# Altium schematic sheet Level Shifter.SchDoc
size A4; DocumentNumber: 4; SheetNumber: 5; SheetTotal: 5
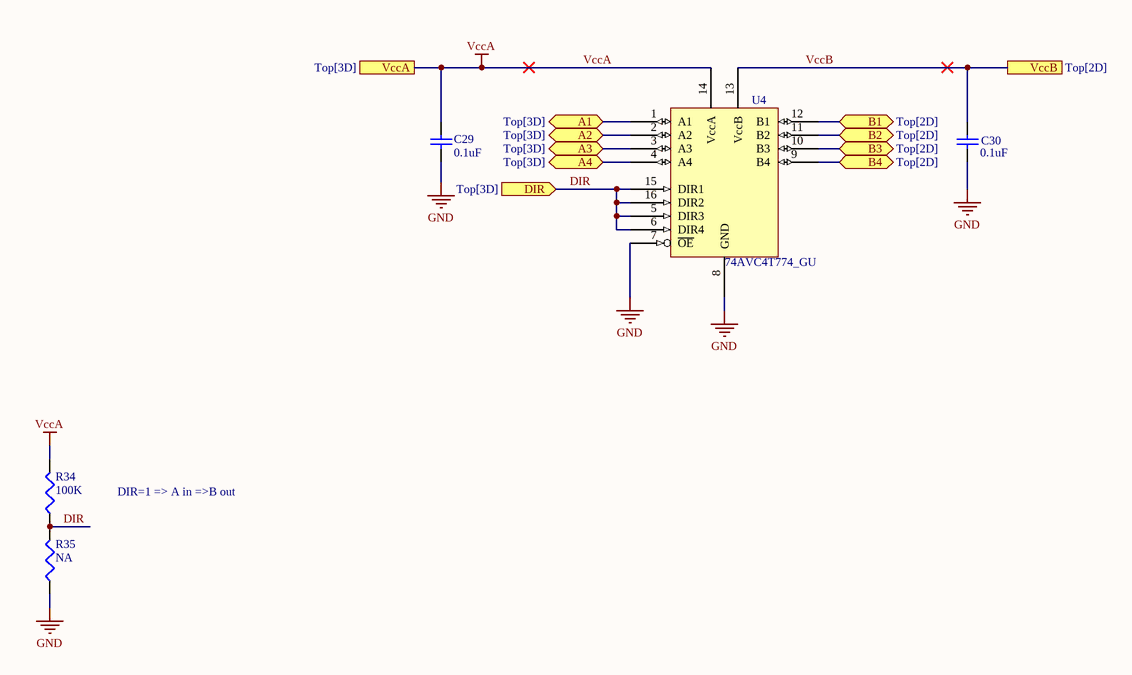
[diagram p0: Level Shifter.SchDoc]

## Parts
C29  Capacitance: 0.1uF  [C0402]  (hidden comment: 0.1uF 50V)
C30  Capacitance: 0.1uF  [C0402]  (hidden comment: 0.1uF 50V)
R34  100K  [R0402]
R35  NA  [R0402]
U4  74AVC4T774_GU  [NXP_74AVC4T245GU,115]

## Ports
A1 (bidir, see Top[3D]), A2 (bidir, see Top[3D]), A3 (bidir, see Top[3D]), A4 (bidir, see Top[3D]), B1 (bidir, see Top[2D]), B2 (bidir, see Top[2D]), B3 (bidir, see Top[2D]), B4 (bidir, see Top[2D]), DIR (in, see Top[3D]), VccA (see Top[3D]), VccB (see Top[2D])

## Nets
GND: C29.1 C30.1 R35.1 U4.7(~{OE}) U4.8(GND)
VccA: C29.2 R34.2 U4.14(VccA) ; port VccA
A1: U4.1(A1) ; port A1
A2: U4.2(A2) ; port A2
A3: U4.3(A3) ; port A3
A4: U4.4(A4) ; port A4
B1: U4.12(B1) ; port B1
B2: U4.11(B2) ; port B2
B3: U4.10(B3) ; port B3
B4: U4.9(B4) ; port B4
DIR: R34.1 R35.2 U4.5(DIR3) U4.6(DIR4) U4.15(DIR1) U4.16(DIR2) ; port DIR
VccB: C30.2 U4.13(VccB) ; port VccB

## Notes on the sheet
- DIR=1 => A in =>B out
- Title
- Size:
- Date:
- A3
- PCB Number:
- SCH Number:
- Time:
- Revision:
- Sheet
- of
- QS-Labs Ltd.
  2A Haim Holtzman Street,Rehovot, Israel
- File:
- Drawn by:

## Library data of the parts
C29 C30 = CAP CER 6.8pF 50V NP0 0402: CAP CER 0.1uF 50V NP0 0402; Manufacturer Part Number: C1005C0G1H6R8D; Manufacturer: TDK Corporation; LANDA P/N: ECP-000033; RoHS: RoHS Compliant; Package / Case: 0402 (1005 Metric); ComponentLink1URL: http://www.tdk.com/pdf/general_B11.pdf; ComponentLink1Description: http://www.tdk.com/pdf/general_B11.pdf; Voltage - Rated: 50V
R34 = RES 3.09K OHM 1/16W 1% 0402: RES 100K OHM 1/16W 1% 0402; Manufacturer Part Number: RMCF0402FT3K09; Manufacturer: Stackpole Electronics Inc; Power (Watts): 0.063W, 1/16W; LANDA P/N: ERS-000063; Supplier Device Package: 0402; Package / Case: 0402 (1005 Metric); RoHS: RoHS Compliant; ComponentLink1URL: http://www.seielect.com/Catalog/SEI-RMCF_RMCP.pdf; ComponentLink1Description: http://www.seielect.com/Catalog/SEI-RMCF_RMCP.pdf
R35 = RES 3.09K OHM 1/16W 1% 0402: Manufacturer Part Number: RMCF0402FT3K09; Manufacturer: Stackpole Electronics Inc; Power (Watts): 0.063W, 1/16W; LANDA P/N: ERS-000063; Supplier Device Package: 0402; Package / Case: 0402 (1005 Metric); RoHS: RoHS Compliant; ComponentLink1URL: http://www.seielect.com/Catalog/SEI-RMCF_RMCP.pdf; ComponentLink1Description: http://www.seielect.com/Catalog/SEI-RMCF_RMCP.pdf